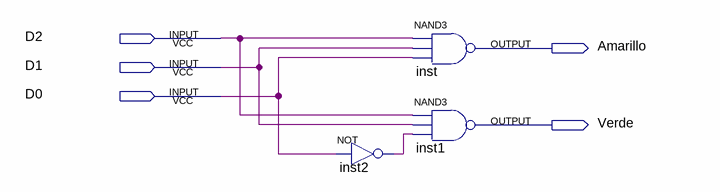
[diagram p0: schematic sheet]
// Quartus schematic Semaforo4.bdf as structural Verilog: 3 symbols, 5 pins
module Semaforo4 (
  input  D2,
  input  D1,
  input  D0,
  output Amarillo,
  output Verde
);

  wire inst2_out;

  not inst2 (inst2_out, D0);
  nand inst (Amarillo, D2, D1, D0);
  nand inst1 (Verde, D2, D1, inst2_out);
endmodule
